# EAGLE schematic v 0.2 (EAGLE 7.5.2)
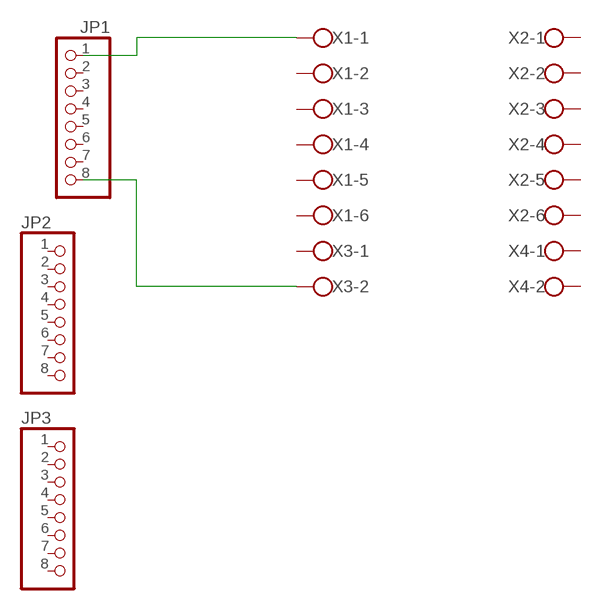
[diagram p0: schematic, sheet 1]

## Parts
JP1  PINHD-1X8  [1X08]
JP2  PINHD-1X8  [1X08]
JP3  PINHD-1X8  [1X08]
X1  W237-136  [W237-136]
X2  W237-136  [W237-136]
X3  W237-136  [W237-136]
X4  W237-136  [W237-136]

## Nets
N$1: JP1.1 X1.1
N$2: JP1.8 X3.2
Unconnected: JP1.2 JP1.3 JP1.4 JP1.5 JP1.6 JP1.7 JP2.1 JP2.2 JP2.3 JP2.4 JP2.5 JP2.6 JP2.7 JP2.8 JP3.1 JP3.2 JP3.3 JP3.4 JP3.5 JP3.6 JP3.7 JP3.8 X1.2 X1.3 X1.4 X1.5 X1.6 X2.1 X2.2 X2.3 X2.4 X2.5 X2.6 X3.1 X3.3 X3.4 X3.5 X3.6 X4.1 X4.2 X4.3 X4.4 X4.5 X4.6

## Library data of the parts
JP1-JP3 = pinhead:PINHD-1X8: PIN HEADER
X1-X4 = con-wago-500:W237-136: WAGO SCREW CLAMP; MPN: 237-136; OC_FARNELL: unknown; OC_NEWARK: 84K9151